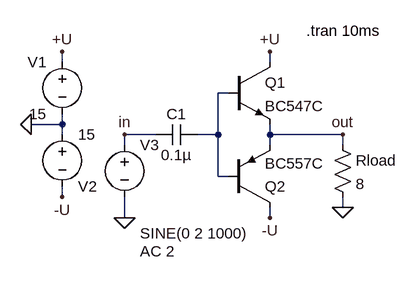
[diagram p0: schematic bipolar-distorting.asc]
bipolar-distorting.asc, the LTspice schematic file:
Version 4
SHEET 1 880 680
WIRE 96 64 96 48
WIRE 416 64 416 48
WIRE 352 112 336 112
WIRE 96 160 96 144
WIRE 96 160 48 160
WIRE 96 176 96 160
WIRE 240 176 192 176
WIRE 336 176 336 112
WIRE 336 176 304 176
WIRE 416 176 416 160
WIRE 528 176 416 176
WIRE 192 192 192 176
WIRE 416 192 416 176
WIRE 528 192 528 176
WIRE 336 240 336 176
WIRE 352 240 336 240
WIRE 96 272 96 256
WIRE 528 288 528 272
WIRE 192 304 192 272
WIRE 416 304 416 288
FLAG 48 160 0
FLAG 96 48 +U
FLAG 96 272 -U
FLAG 416 304 -U
FLAG 416 48 +U
FLAG 192 304 0
FLAG 528 288 0
FLAG 192 176 in
FLAG 528 176 out
SYMBOL voltage 96 48 M0
WINDOW 123 0 0 Left 2
WINDOW 39 24 124 Left 2
SYMATTR InstName V1
SYMATTR Value 15
SYMBOL voltage 96 160 R0
WINDOW 0 24 96 Left 2
WINDOW 3 24 16 Left 2
WINDOW 123 0 0 Left 2
WINDOW 39 24 -12 Left 2
SYMATTR InstName V2
SYMATTR Value 15
SYMBOL npn 352 64 R0
SYMATTR InstName Q1
SYMATTR Value BC547C
SYMBOL pnp 352 288 M180
SYMATTR InstName Q2
SYMATTR Value BC557C
SYMBOL voltage 192 176 R0
WINDOW 3 24 152 Left 2
WINDOW 123 24 180 Left 2
WINDOW 39 24 180 Left 2
SYMATTR InstName V3
SYMATTR Value SINE(0 2 1000)
SYMATTR Value2 AC 2
SYMBOL res 512 176 R0
SYMATTR InstName Rload
SYMATTR Value 8
SYMBOL cap 304 160 R90
WINDOW 0 0 32 VBottom 2
WINDOW 3 32 32 VTop 2
SYMATTR InstName C1
SYMATTR Value 0.1µ
TEXT 472 16 Left 2 !.tran 10ms

The netlist it stands for:
* bipolar-distorting.asc
V1 +U 0 15
V2 0 -U 15
Q1 +U N001 out 0 BC547C
Q2 -U N001 out 0 BC557C
V3 in 0 SINE(0 2 1000) AC 2
Rload out 0 8
C1 N001 in 0.1µ
.model NPN NPN
.model PNP PNP
.lib standard.bjt
.tran 10ms
.backanno
.end